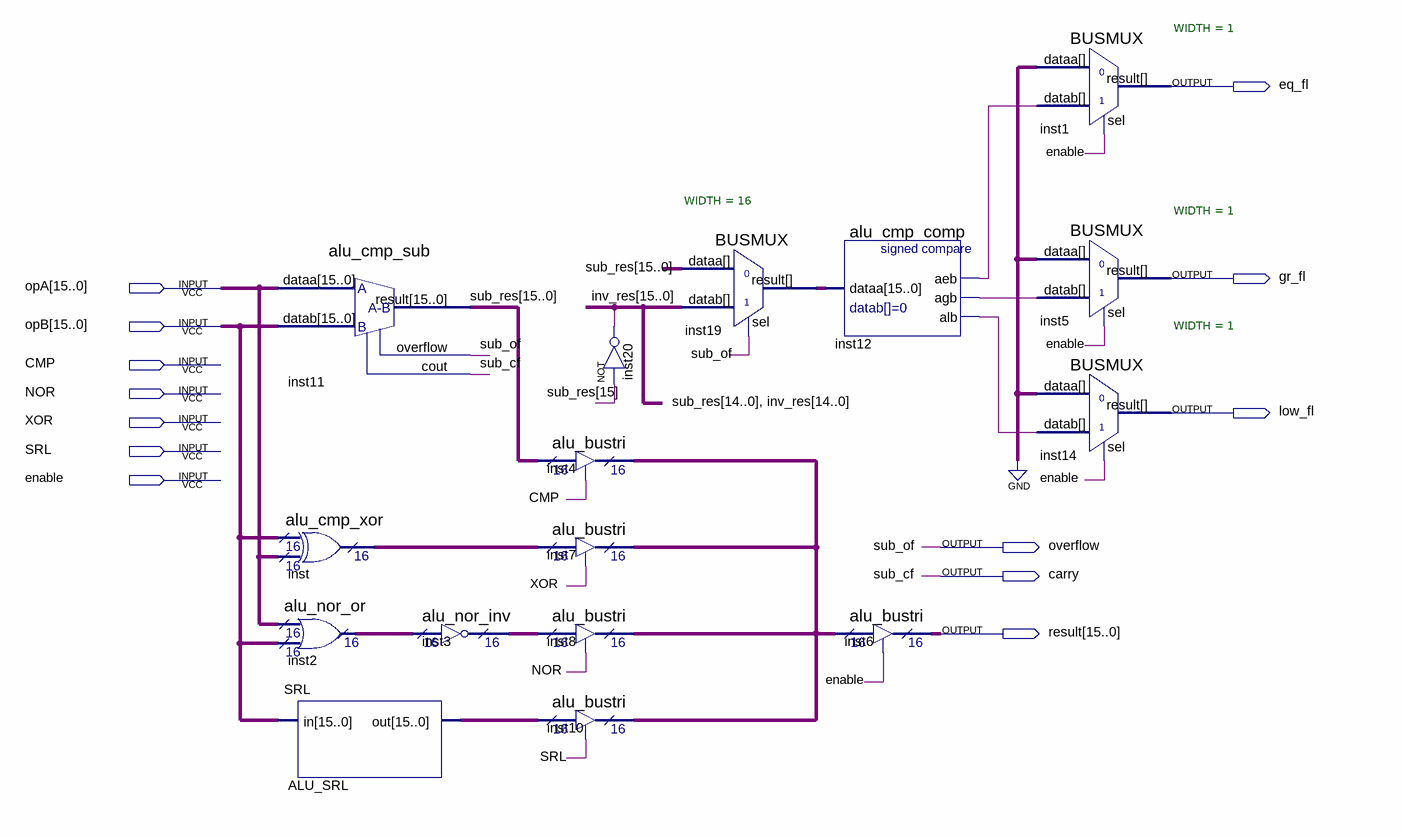
[diagram p0: schematic sheet]
// Quartus schematic ALU.bdf as structural Verilog: 16 symbols, 13 pins
module ALU (
  input  [15:0] opA,
  input  [15:0] opB,
  input  CMP,
  input  NOR,
  input  XOR,
  input  SRL,
  input  enable,
  output eq_fl,
  output gr_fl,
  output low_fl,
  output overflow,
  output carry,
  output [15:0] result
);

  wire inst12_aeb, inst12_agb, inst12_alb;
  wire [15:0] ALU_SRL_out, inst2_result, inst3_result, inst4_tridata, inst19_result, inst_result, inv_res,
       sub_res;

  alu_cmp_sub inst11 (.dataa(opA), .datab(opB), .result(sub_res), .overflow(overflow), .cout(carry));
  alu_cmp_xor inst (.data0x(opB), .data1x(opA), .result(inst_result));
  alu_nor_or inst2 (.data0x(opA), .data1x(opB), .result(inst2_result));
  SRL ALU_SRL (.in(opB), .out(ALU_SRL_out));
  alu_nor_inv inst3 (.data(inst2_result), .result(inst3_result));
  alu_bustri inst4 (.enabledt(CMP), .data(sub_res), .tridata(inst4_tridata));
  alu_bustri inst7 (.enabledt(XOR), .data(inst_result), .tridata(inst4_tridata));
  alu_bustri inst8 (.enabledt(NOR), .data(inst3_result), .tridata(inst4_tridata));
  alu_bustri inst10 (.enabledt(SRL), .data(ALU_SRL_out), .tridata(inst4_tridata));
  not inst20 (inv_res[15], sub_res[15]);
  BUSMUX #(.WIDTH(16)) inst19 (
    .datab({sub_res[14:0], inv_res[14:0]}), .sel(overflow), .dataa(sub_res), .result(inst19_result));
  alu_cmp_comp inst12 (.dataa(inst19_result), .aeb(inst12_aeb), .agb(inst12_agb), .alb(inst12_alb));
  alu_bustri inst6 (.enabledt(enable), .data(inst4_tridata), .tridata(result));
  BUSMUX #(.WIDTH(1)) inst1 (.datab(inst12_aeb), .sel(enable), .dataa(1'b0), .result(eq_fl));
  BUSMUX #(.WIDTH(1)) inst5 (.datab(inst12_agb), .sel(enable), .dataa(1'b0), .result(gr_fl));
  BUSMUX #(.WIDTH(1)) inst14 (.datab(inst12_alb), .sel(enable), .dataa(1'b0), .result(low_fl));

  // Other names for the same wires on the sheet: sub_cf = carry; sub_of = overflow
endmodule
